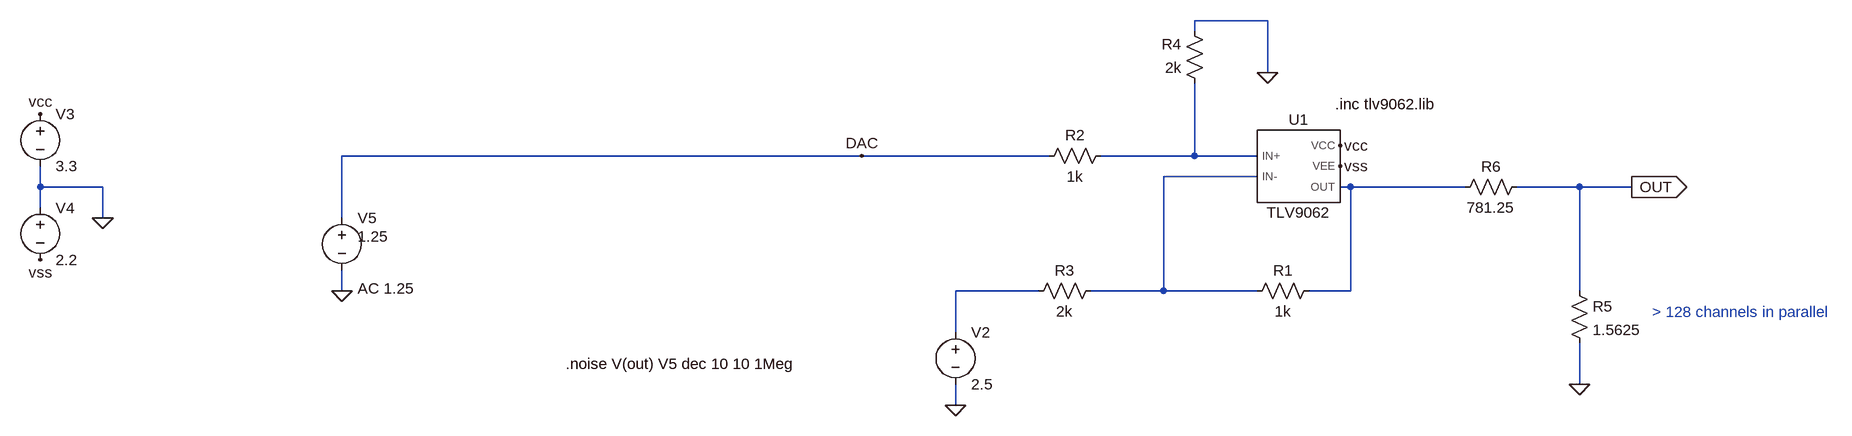
[diagram p0: schematic ad5683_unipolar-to-bipolar_noise.asc]
ad5683_unipolar-to-bipolar_noise.asc, the LTspice schematic file:
Version 4
SHEET 1 2204 756
WIRE 688 -80 576 -80
WIRE 576 -64 576 -80
WIRE 688 0 688 -80
WIRE 64 128 -736 128
WIRE 352 128 64 128
WIRE 576 128 576 16
WIRE 576 128 432 128
WIRE 672 128 576 128
WIRE 672 160 528 160
WIRE -1200 176 -1200 144
WIRE -1104 176 -1200 176
WIRE 816 176 800 176
WIRE 992 176 816 176
WIRE 1168 176 1072 176
WIRE 1248 176 1168 176
WIRE -1200 208 -1200 176
WIRE -1104 224 -1104 176
WIRE -736 224 -736 128
WIRE -736 336 -736 304
WIRE 336 336 208 336
WIRE 528 336 528 160
WIRE 528 336 416 336
WIRE 672 336 528 336
WIRE 816 336 816 176
WIRE 816 336 752 336
WIRE 1168 336 1168 176
WIRE 208 400 208 336
WIRE 1168 480 1168 416
WIRE 208 512 208 480
FLAG 208 512 0
FLAG 800 112 vcc
FLAG 800 144 vss
FLAG -1104 224 0
FLAG -1200 288 vss
FLAG -1200 64 vcc
FLAG 688 0 0
FLAG -736 336 0
FLAG 1168 480 0
FLAG 64 128 DAC
FLAG 1248 176 OUT
IOPIN 1248 176 Out
SYMBOL voltage 208 384 R0
WINDOW 123 0 0 Left 0
WINDOW 39 0 0 Left 0
SYMATTR InstName V2
SYMATTR Value 2.5
SYMBOL res 768 320 R90
WINDOW 0 0 56 VBottom 2
WINDOW 3 32 56 VTop 2
SYMATTR InstName R1
SYMATTR Value 1k
SYMBOL voltage -1200 48 R0
WINDOW 123 0 0 Left 0
WINDOW 39 0 0 Left 0
SYMATTR InstName V3
SYMATTR Value 3.3
SYMBOL voltage -1200 192 R0
WINDOW 123 0 0 Left 0
WINDOW 39 0 0 Left 0
SYMATTR InstName V4
SYMATTR Value 2.2
SYMBOL res 320 352 R270
WINDOW 0 32 56 VTop 2
WINDOW 3 0 56 VBottom 2
SYMATTR InstName R3
SYMATTR Value 2k
SYMBOL res 336 144 R270
WINDOW 0 32 56 VTop 2
WINDOW 3 0 56 VBottom 2
SYMATTR InstName R2
SYMATTR Value 1k
SYMBOL res 592 32 R180
WINDOW 0 36 76 Left 2
WINDOW 3 36 40 Left 2
SYMATTR InstName R4
SYMATTR Value 2k
SYMBOL TLV9062 736 144 R0
SYMATTR InstName U1
SYMBOL voltage -736 208 R0
WINDOW 123 24 124 Left 2
WINDOW 39 0 0 Left 0
WINDOW 3 24 44 Left 2
SYMATTR Value2 AC 1.25
SYMATTR InstName V5
SYMATTR Value 1.25
SYMBOL res 1152 320 R0
SYMATTR InstName R5
SYMATTR Value 1.5625
SYMBOL res 1088 160 R90
WINDOW 0 0 56 VBottom 2
WINDOW 3 32 56 VTop 2
SYMATTR InstName R6
SYMATTR Value 781.25
TEXT 792 48 Left 2 !.inc tlv9062.lib
TEXT -392 448 Left 2 !.noise V(out) V5 dec 10 10 1Meg
TEXT 1280 368 Left 2 ;> 128 channels in parallel

The netlist it stands for:
* ad5683_unipolar-to-bipolar_noise.asc
V2 N004 0 2.5
R1 N003 N002 1k
V3 vcc 0 3.3
V4 0 vss 2.2
R3 N004 N002 2k
R2 DAC N001 1k
R4 N001 0 2k
XU1 N001 N002 vcc vss N003 TLV9062  ; pins IN+ IN- VCC VEE OUT
V5 DAC 0 1.25 AC 1.25
R5 OUT 0 1.5625
R6 OUT N003 781.25
.inc tlv9062.lib
.noise V(out) V5 dec 10 10 1Meg
* > 128 channels in parallel
.lib tlv9062.lib
.backanno
.end